# Altium schematic sheet encodeur_rotor_rpm.SchDoc
size A4; SheetNumber: 6; SheetTotal: 12
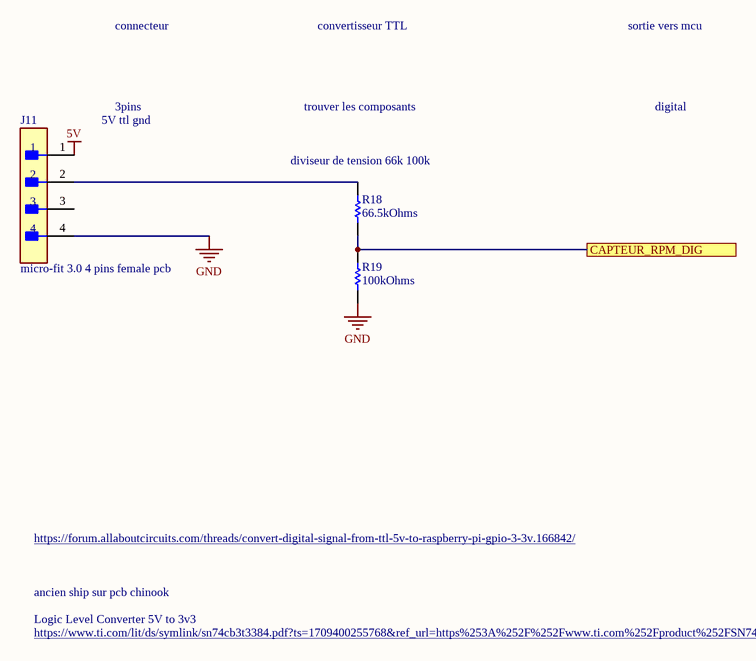
[diagram p0: encodeur_rotor_rpm.SchDoc]

## Parts
J11  micro-fit 3.0 4 pins female pcb  [FP-43045-0400-MFG]
R18  66.5kOhms  [RESC1005X40X25LL05T10]
R19  100kOhms  [RESC1005X40X25NL05T10]

## Ports
CAPTEUR_RPM_DIG

## Nets
5V: J11.1
GND: J11.4 R19.1
CAPTEUR_RPM_DIG: R18.1 R19.2 ; port CAPTEUR_RPM_DIG
NetJ11_2: J11.2 R18.2

Not connected (* = marked no-connect by the designer): J11 3

## Notes on the sheet
- connecteur
- convertisseur TTL
- sortie vers mcu
- 5V ttl gnd
- 3pins
- trouver les composants
- digital
- (near R18) diviseur de tension 66k 100k
- https://forum.allaboutcircuits.com/threads/convert-digital-signal-from-ttl-5v-to-raspberry-pi-gpio-3-3v.166842/
- Logic Level Converter 5V to 3v3
- ancien ship sur pcb chinook
- https://www.ti.com/lit/ds/symlink/sn74cb3t3384.pdf?ts=1709400255768&ref_url=https%253A%252F%252Fwww.ti.com%252Fproduct%252FSN74CB3T3384%253FHQS%253Dti-null-null-verifimanuf_manuf-manu-pf-octopart-wwe

## Library data of the parts
J11 = 430450400: MOLEX 43045-0400 Header, Dual Row, 90°, 4p, Tin Plating Snap-in Peg PCB Lock, GW Compatible; Plating: 154ConductorMaterial; Number of Contacts: 4; Contact Resistance: 10mR; Max Voltage Rating (AC): 250V; Current Rating: 5A; Voltage Rating: 600V; Gender: Male; Max Voltage Rating (DC): 250.25kV; Pitch: 3mm; Row Spacing: 0.118inch; Approvals: UL,CSA,TUV; Glow Wire Compliant: 15Compliance; Supplier: Digikey; Supplier Part Number: WM1814-ND; Manufacturer: Molex; Manufacturer Part Number: 43045-0400; RoHS: Yes; Category: Headers and Wire Housings; Stock: 4691; Pricing: 1=1.51, 10=1.289, 80=1.065, 2232=0.8128, 6696=0.74553, 11160=0.72872 (USD); Mounting Technology: Through Hole; Case/Package: 101Case; Contact Plating: Tin; Contact Material: Brass,Tin; Color: Black; Housing Color: Black; Housing Material: Thermoplastic; Material: Polyester; Min Operating Temperature: -40°C; Max Operating Temperature: 105°C; Number of Rows: 2; Termination: Solder; Packaging: Tray; Fastening Type: Ramp; Number of Positions: 4; Orientation: Right Angle; Contact Gender: Male; Series: Micro-Fit 3.0™ 43045; Contact Type: Male Pin; Number of Circuits: 4; Number of Poles: 4; Voltage Rating (AC): 250V; Working Voltage: 250V; Voltage Rating (DC): 250V; Diameter: 3mm; Length: 10.15mm; Width: 9.9mm; Lead Pitch: 3mm; Depth: 12.2mm; Radiation Hardening: No; RoHS Compliant: Yes; Reach SVHC Compliant: Unknown; Flammability Rating: 5813Flammability; Halogen Free: 5696HalogenFree; Lead Free: 5697LeadFree; ComponentLink1URL: https://datasheet.ciiva.com/11746/0900766b80027348-11746988.pdf?src-supplier=Rs; ComponentLink1Description: https://datasheet.ciiva.com/11746/0900766b80027348-11746988.pdf?src-supplier=Rs
R18 = RC0402FR-0766K5L: SMD Chip Resistor, 66.5 kOhm, ± 1%, 63 mW, 0402 [1005 Metric], Thick Film, General Purpose; Manufacturer: Yageo; Value: 66.5kR; Temperature Coefficient: 100ppm/°C; Power Rating: 62.5mW; Voltage Rating: 50V; Max Power Dissipation: 63mW; Supplier: Digikey; Supplier Part Number: YAG3209CT-ND; Manufacturer Part Number: RC0402FR-0766K5L; RoHS: Yes; Category: Chip SMD Resistors; Stock: 358270; Pricing: 1=0.1, 10=0.015, 50=0.0088, 100=0.0073, 500=0.00488, 1000=0.00417, 5000=0.00297 (USD); Case/Package: 0402; Contact Plating: Tin,Matte; Case Code (Imperial): 0402; Case Code (Metric): 1005; Min Operating Temperature: -55°C; Max Operating Temperature: 155°C; Tolerance: 1%; Packaging: Tape and Reel; Number of Terminations: 2; Termination: SMD/SMT; Features: Moisture Resistant; Series: RC; Length: 0.039inch; Width: 0.5mm; Height: 0.016inch; Lead Free: Lead Free; RoHS Compliant: Yes; ComponentLink1URL: https://datasheet.ciiva.com/8888/pyu-rc0402-51-rohs-l-6-8888485.pdf?src-supplier=Avnet; ComponentLink1Description: https://datasheet.ciiva.com/8888/pyu-rc0402-51-rohs-l-6-8888485.pdf?src-supplier=Avnet
R19 = RC0402FR-07100KL: SMD Chip Resistor, 100 kOhm, ± 1%, 63 mW, 0402 [1005 Metric], Thick Film, General Purpose; Manufacturer: Yageo; Value: 100kR; Temperature Coefficient: 100ppm/°C; Power Rating: 63mW; Voltage Rating: 50V; Supplier: Digikey; Supplier Part Number: 311-100KLRCT-ND; Manufacturer Part Number: RC0402FR-07100KL; RoHS: Yes; Category: Chip SMD Resistors; Stock: 21909209; Pricing: 1=0.1, 10=0.015, 50=0.0088, 100=0.0073, 500=0.00488, 1000=0.00417, 5000=0.00297 (USD); Case/Package: 0402; Case Code (Metric): 1005; Case Code (Imperial): 0402; Min Operating Temperature: -55°C; Max Operating Temperature: 155°C; Resistor Type: Thick Film; Tolerance: 1%; Packaging: Tape and Reel; Package Quantity: 1; Number of Terminations: 2; Termination: SMD/SMT; Max Power Dissipation: 63mW; Features: Moisture Resistant; Series: RC; Resistance Tolerance: 1%; Construction: Rectangular; Technology: THICK FILM; Voltage Rating (AC): 50V; Length: 0.039inch; Width: 0.02inch; Height: 0.016inch; Depth: 0.5mm; Reach SVHC Compliant: No; RoHS Compliant: Yes; Lead Free: 5697LeadFree; Military Standard: Not; ComponentLink1URL: https://datasheet.ciiva.com/11819/0900766b80c66297-11819452.pdf?src-supplier=Rs; ComponentLink1Description: https://datasheet.ciiva.com/11819/0900766b80c66297-11819452.pdf?src-supplier=Rs; ComponentLink2URL: https://datasheet.ciiva.com/22747/1018594-22747509.pdf?src-supplier=Element14; ComponentLink2Description: https://datasheet.ciiva.com/22747/1018594-22747509.pdf?src-supplier=Element14; ComponentLink3URL: https://datasheet.ciiva.com/2453/pyu-r-int-thick-7-2453362.pdf?src-supplier=Digikey; ComponentLink3Description: https://datasheet.ciiva.com/2453/pyu-r-int-thick-7-2453362.pdf?src-supplier=Digikey; ComponentLink4URL: https://datasheet.ciiva.com/12667/pyu-rc0402-51-rohs-l-6-r-12667930.pdf?src-supplier=Mouser; ComponentLink4Description: https://datasheet.ciiva.com/12667/pyu-rc0402-51-rohs-l-6-r-12667930.pdf?src-supplier=Mouser; ComponentLink5URL: https://datasheet.ciiva.com/15189/getdatasheetpartid-323696-15189334.pdf?src-supplier=Verical; ComponentLink5Description: https://datasheet.ciiva.com/15189/getdatasheetpartid-323696-15189334.pdf?src-supplier=Verical; ComponentLink6URL: https://datasheet.ciiva.com/2453/pyu-r-int-thick-7-2453363.pdf?src-supplier=Digikey; ComponentLink6Description: https://datasheet.ciiva.com/2453/pyu-r-int-thick-7-2453363.pdf?src-supplier=Digikey; ComponentLink7URL: https://datasheet.ciiva.com/2453/pyu-r-int-thick-7-2453361.pdf?src-supplier=Digikey; ComponentLink7Description: https://datasheet.ciiva.com/2453/pyu-r-int-thick-7-2453361.pdf?src-supplier=Digikey